# EAGLE design mainboard-1 (EAGLE 5.07)

## Sheet 1 of 3
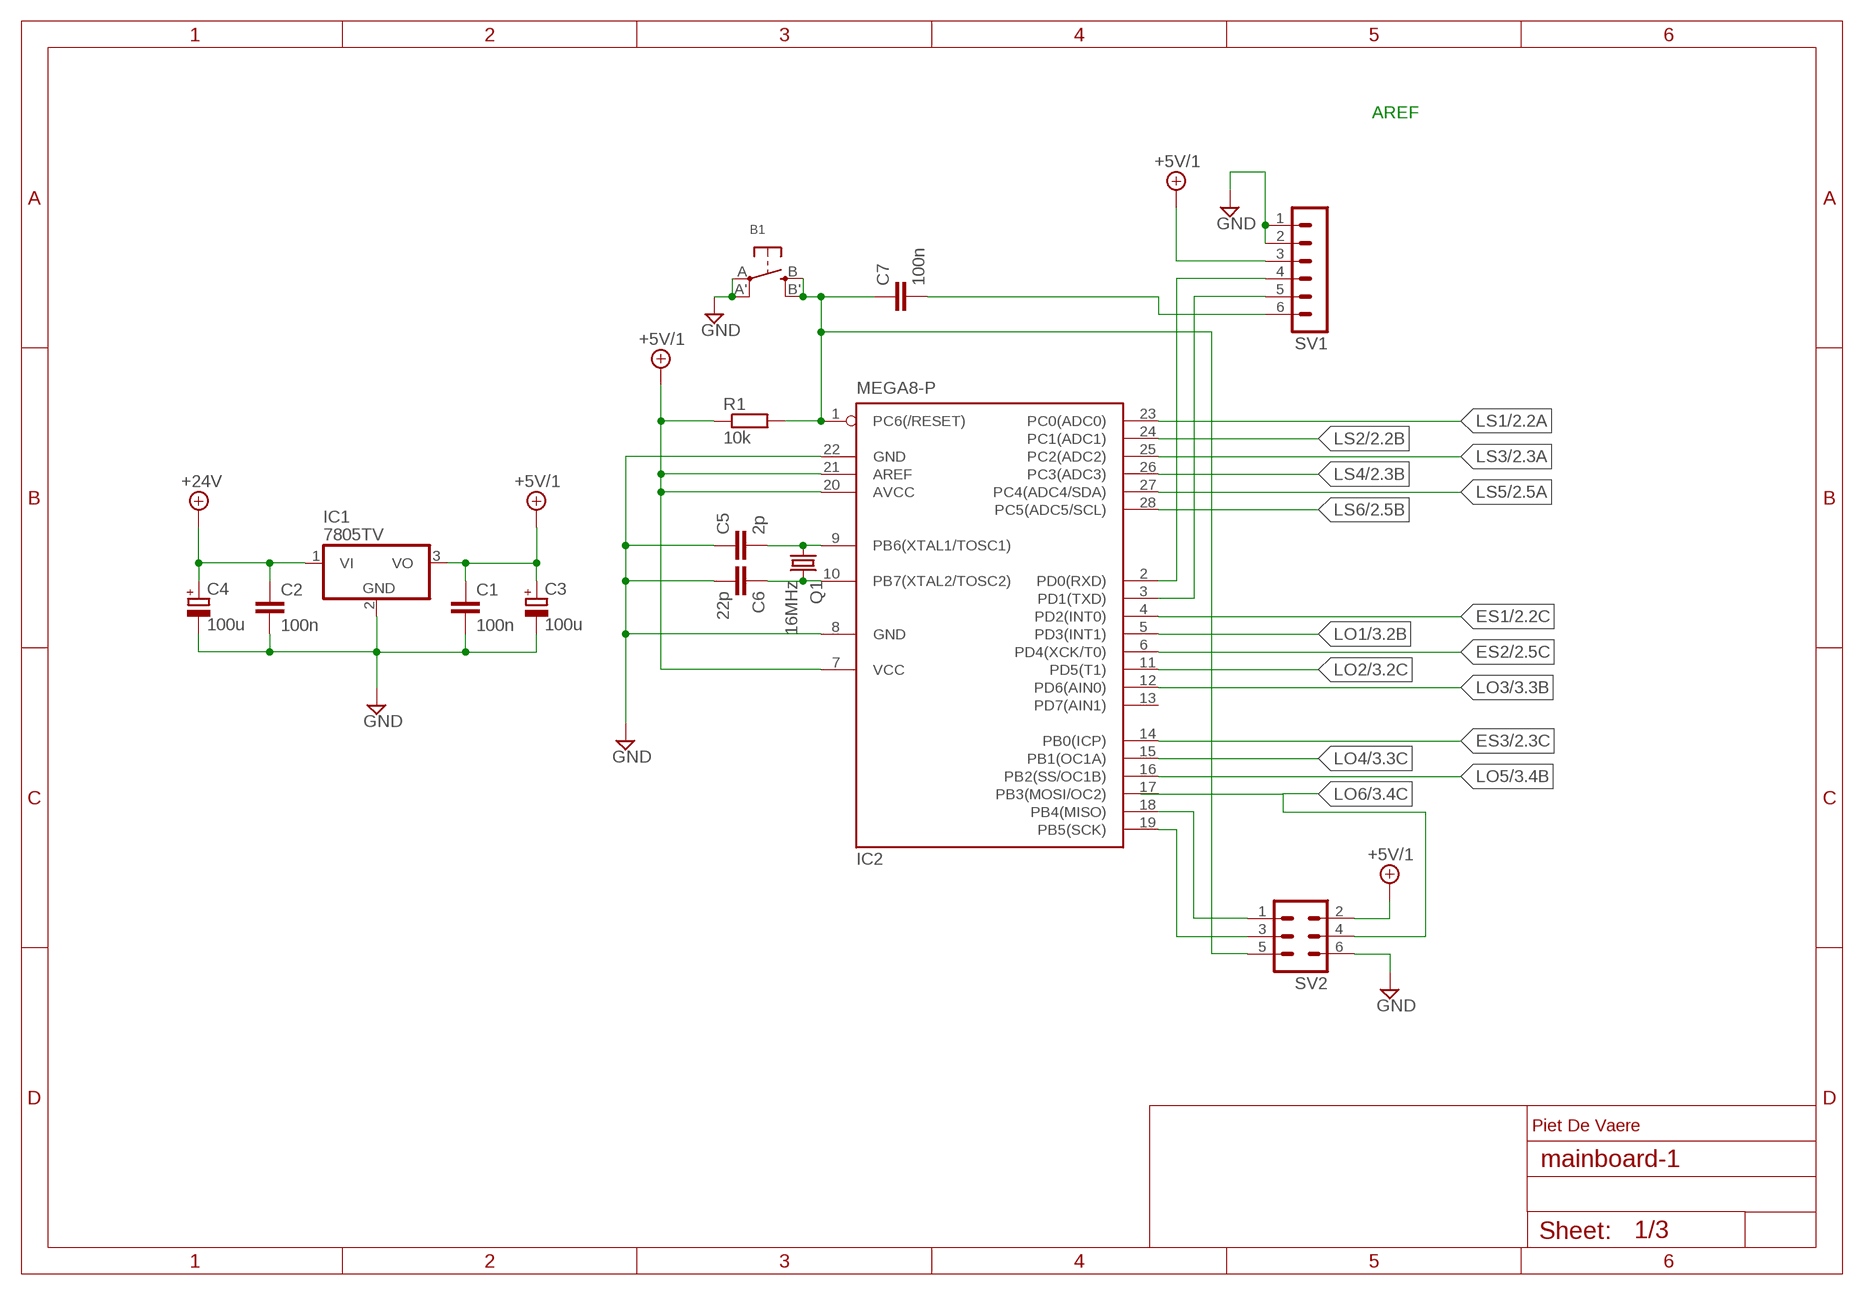
[diagram p0: schematic, sheet 1]

### Parts
B1  SWITCH_TACT_SMT  [EVQ-Q2]
C1  100n  C-EU025-030X050  [C025-030X050]
C2  100n  C-EU025-030X050  [C025-030X050]
C3  100u  CPOL-EUE3.5-10  [E3,5-10]
C4  100u  CPOL-EUE3.5-10  [E3,5-10]
C5  2p  C-EU025-030X050  [C025-030X050]
C6  22p  C-EU025-030X050  [C025-030X050]
C7  100n  C-EU025-030X050  [C025-030X050]
IC1  7805TV  [TO220V]
IC2  MEGA8-P  [DIL28-3]
Q1  16MHz  CRYSTALHC49S  [HC49/S]
R1  10k  R-EU_0207/10  [0207/10]
SV1  MA06-1  [MA06-1]
SV2  MA03-2  [MA03-2]

### Nets
+5V/1: C1.1 C3.+ IC1.3(VO) IC2.7(VCC) IC2.20(AVCC) IC2.21(AREF) R1.1 SV1.3 SV2.2 ; also sheet 2
+24V: C2.1 C4.+ IC1.1(VI)
ES1: IC2.4(PD2(INT0)) ; also sheet 2
ES2: IC2.6(PD4(XCK/T0)) ; also sheet 2
ES3: IC2.14(PB0(ICP)) ; also sheet 2
GND [HP]: B1.A'(P1) B1.A(P) C1.2 C2.2 C3.- C4.- C5.1 C6.2 IC1.2(GND) IC2.8(GND) IC2.22(GND) SV1.1 SV1.2 SV2.6 ; also sheet 2,3
LO1: IC2.5(PD3(INT1)) ; also sheet 3
LO2: IC2.11(PD5(T1)) ; also sheet 3
LO3: IC2.12(PD6(AIN0)) ; also sheet 3
LO4: IC2.15(PB1(OC1A)) ; also sheet 3
LO5: IC2.16(PB2(SS/OC1B)) ; also sheet 3
LO6: SV2.4 ; also sheet 3
LS1: IC2.23(PC0(ADC0)) ; also sheet 2
LS2: IC2.24(PC1(ADC1)) ; also sheet 2
LS3: IC2.25(PC2(ADC2)) ; also sheet 2
LS4: IC2.26(PC3(ADC3)) ; also sheet 2
LS5: IC2.27(PC4(ADC4/SDA)) ; also sheet 2
LS6: IC2.28(PC5(ADC5/SCL)) ; also sheet 2
N$2: C6.1 IC2.10(PB7(XTAL2/TOSC2)) Q1.2
N$3: C5.2 IC2.9(PB6(XTAL1/TOSC1)) Q1.1
N$4: IC2.19(PB5(SCK)) SV2.3
N$5: IC2.18(PB4(MISO)) SV2.1
N$6: IC2.2(PD0(RXD)) SV1.4
N$7: IC2.3(PD1(TXD)) SV1.5
N$8: C7.2 SV1.6
RESET: B1.B'(S1) B1.B(S) C7.1 IC2.1(PC6(/RESET)) R1.2 SV2.5
Unconnected: IC2.13(PD7(AIN1)) IC2.17(PB3(MOSI/OC2))

### Notes on the sheet
- AREF
- Piet De Vaere

## Sheet 2 of 3
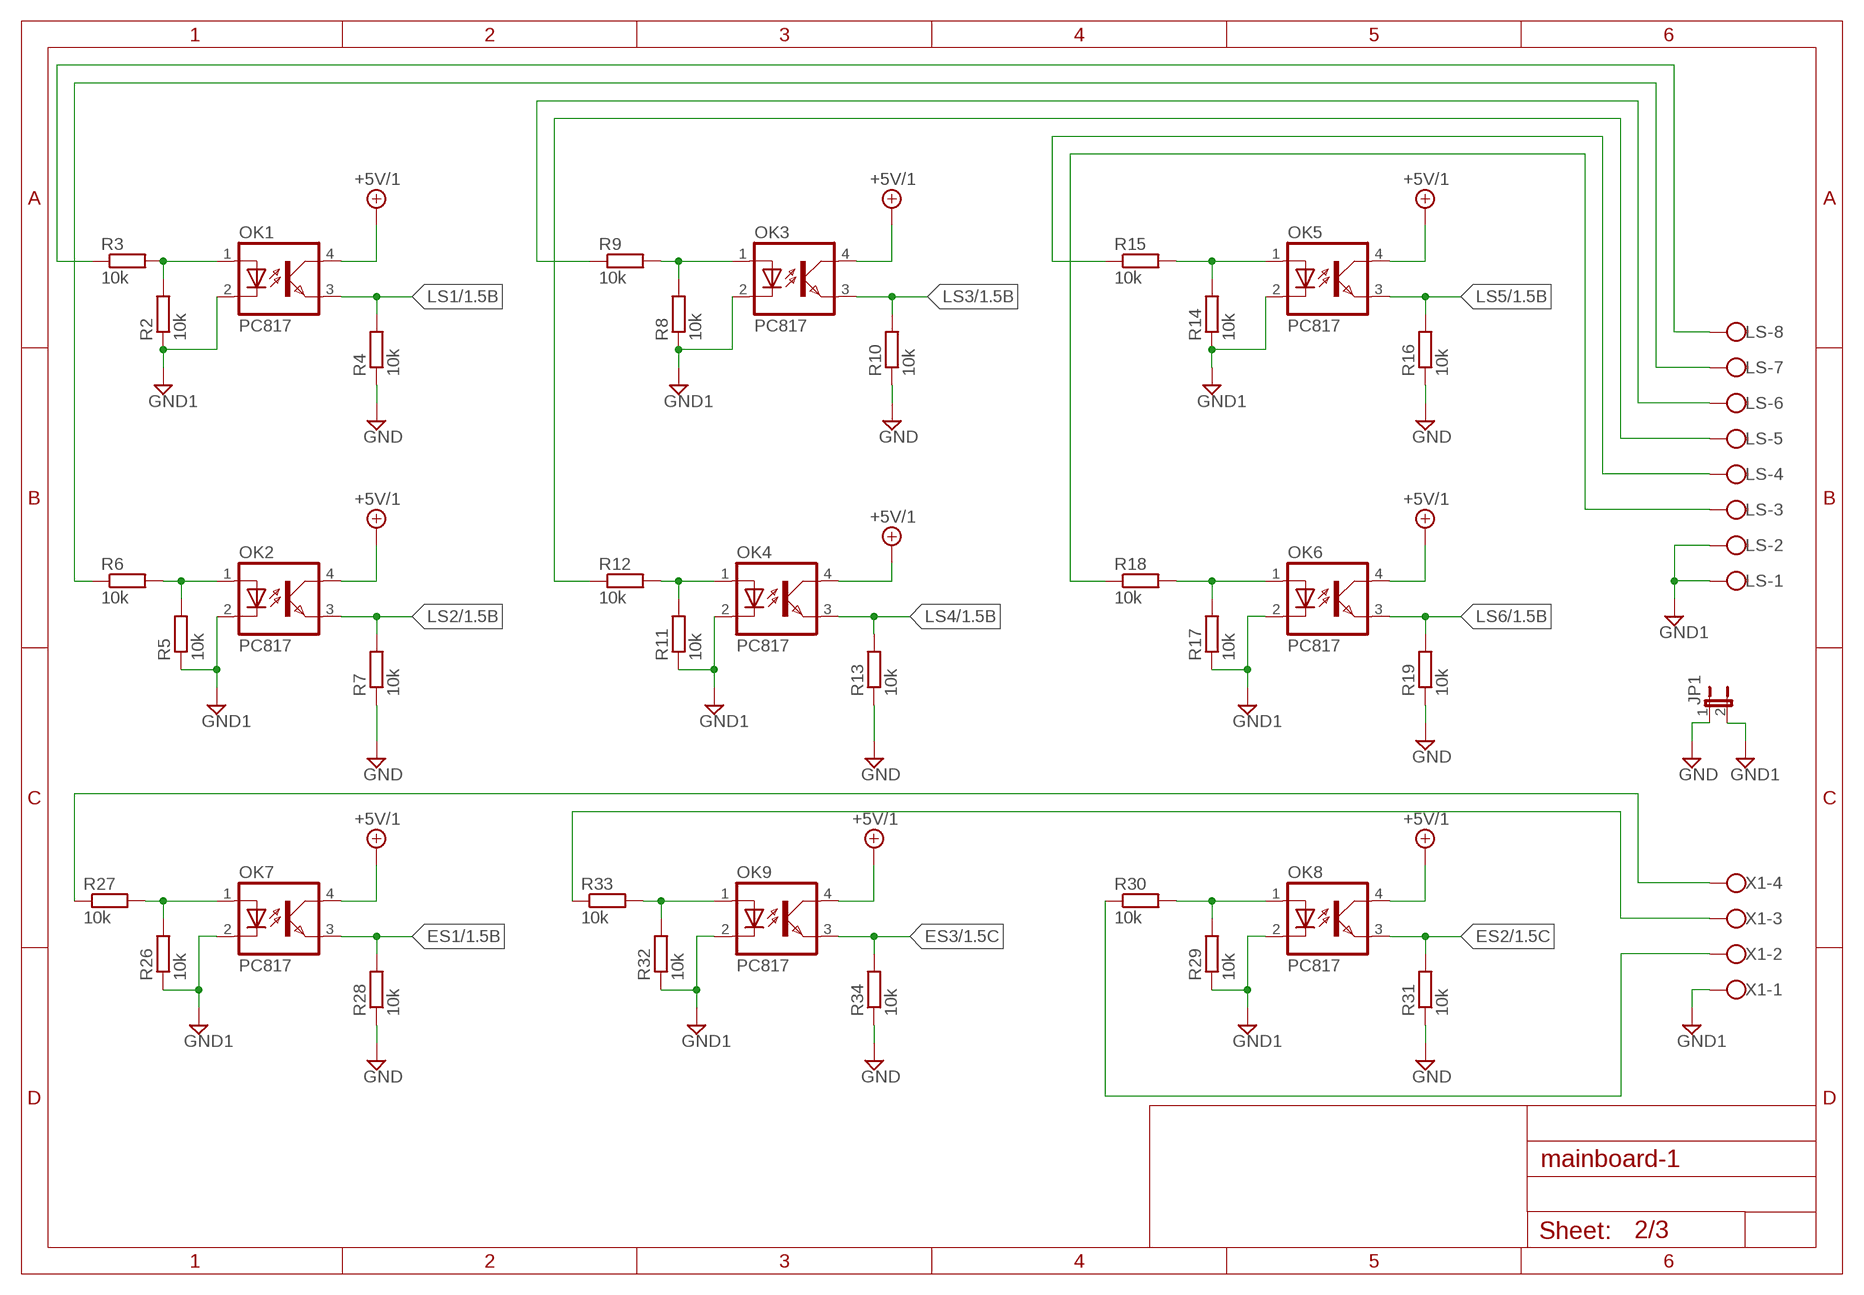
[diagram p1: schematic, sheet 2]

### Parts
JP1  JP1E  [JP1]
LS  W237-08P  [W237-8P]
OK1  PC817  [DIL04]
OK2  PC817  [DIL04]
OK3  PC817  [DIL04]
OK4  PC817  [DIL04]
OK5  PC817  [DIL04]
OK6  PC817  [DIL04]
OK7  PC817  [DIL04]
OK8  PC817  [DIL04]
OK9  PC817  [DIL04]
R2  10k  R-EU_0207/10  [0207/10]
R3  10k  R-EU_0207/10  [0207/10]
R4  10k  R-EU_0207/10  [0207/10]
R5  10k  R-EU_0207/10  [0207/10]
R6  10k  R-EU_0207/10  [0207/10]
R7  10k  R-EU_0207/10  [0207/10]
R8  10k  R-EU_0207/10  [0207/10]
R9  10k  R-EU_0207/10  [0207/10]
R10  10k  R-EU_0207/10  [0207/10]
R11  10k  R-EU_0207/10  [0207/10]
R12  10k  R-EU_0207/10  [0207/10]
R13  10k  R-EU_0207/10  [0207/10]
R14  10k  R-EU_0207/10  [0207/10]
R15  10k  R-EU_0207/10  [0207/10]
R16  10k  R-EU_0207/10  [0207/10]
R17  10k  R-EU_0207/10  [0207/10]
R18  10k  R-EU_0207/10  [0207/10]
R19  10k  R-EU_0207/10  [0207/10]
R26  10k  R-EU_0207/10  [0207/10]
R27  10k  R-EU_0207/10  [0207/10]
R28  10k  R-EU_0207/10  [0207/10]
R29  10k  R-EU_0207/10  [0207/10]
R30  10k  R-EU_0207/10  [0207/10]
R31  10k  R-EU_0207/10  [0207/10]
R32  10k  R-EU_0207/10  [0207/10]
R33  10k  R-EU_0207/10  [0207/10]
R34  10k  R-EU_0207/10  [0207/10]
X1  W237-04P  [W237-4P]

### Nets
+5V/1: OK1.4(COL) OK2.4(COL) OK3.4(COL) OK4.4(COL) OK5.4(COL) OK6.4(COL) OK7.4(COL) OK8.4(COL) OK9.4(COL) ; also sheet 1
ES1: OK7.3(EMIT) R28.2 ; also sheet 1
ES2: OK8.3(EMIT) R31.2 ; also sheet 1
ES3: OK9.3(EMIT) R34.2 ; also sheet 1
GND [HP]: JP1.1 R4.1 R7.1 R10.1 R13.1 R16.1 R19.1 R28.1 R31.1 R34.1 ; also sheet 1,3
GND1: JP1.2 LS.1 LS.2 OK1.2(C) OK2.2(C) OK3.2(C) OK4.2(C) OK5.2(C) OK6.2(C) OK7.2(C) OK8.2(C) OK9.2(C) R2.1 R5.1 R8.1 R11.1 R14.1 R17.1 R26.1 R29.1 R32.1 X1.1
LS1: OK1.3(EMIT) R4.2 ; also sheet 1
LS2: OK2.3(EMIT) R7.2 ; also sheet 1
LS3: OK3.3(EMIT) R10.2 ; also sheet 1
LS4: OK4.3(EMIT) ; also sheet 1
LS5: OK5.3(EMIT) R16.2 ; also sheet 1
LS6: OK6.3(EMIT) R19.2 ; also sheet 1
N$1: OK1.1(A) R2.2 R3.2
N$10: LS.8 R3.1
N$11: OK2.1(A) R5.2 R6.2
N$12: LS.7 R6.1
N$13: OK3.1(A) R8.2 R9.2
N$14: LS.6 R9.1
N$15: OK4.1(A) R11.2 R12.2
N$16: LS.5 R12.1
N$17: OK5.1(A) R14.2 R15.2
N$18: LS.4 R15.1
N$19: OK6.1(A) R17.2 R18.2
N$20: LS.3 R18.1
N$26: OK7.1(A) R26.2 R27.2
N$27: OK8.1(A) R29.2 R30.2
N$28: R27.1 X1.4
N$29: R33.1 X1.3
N$30: OK9.1(A) R32.2 R33.2
N$31: R30.1 X1.2
N$33: R13.2

## Sheet 3 of 3
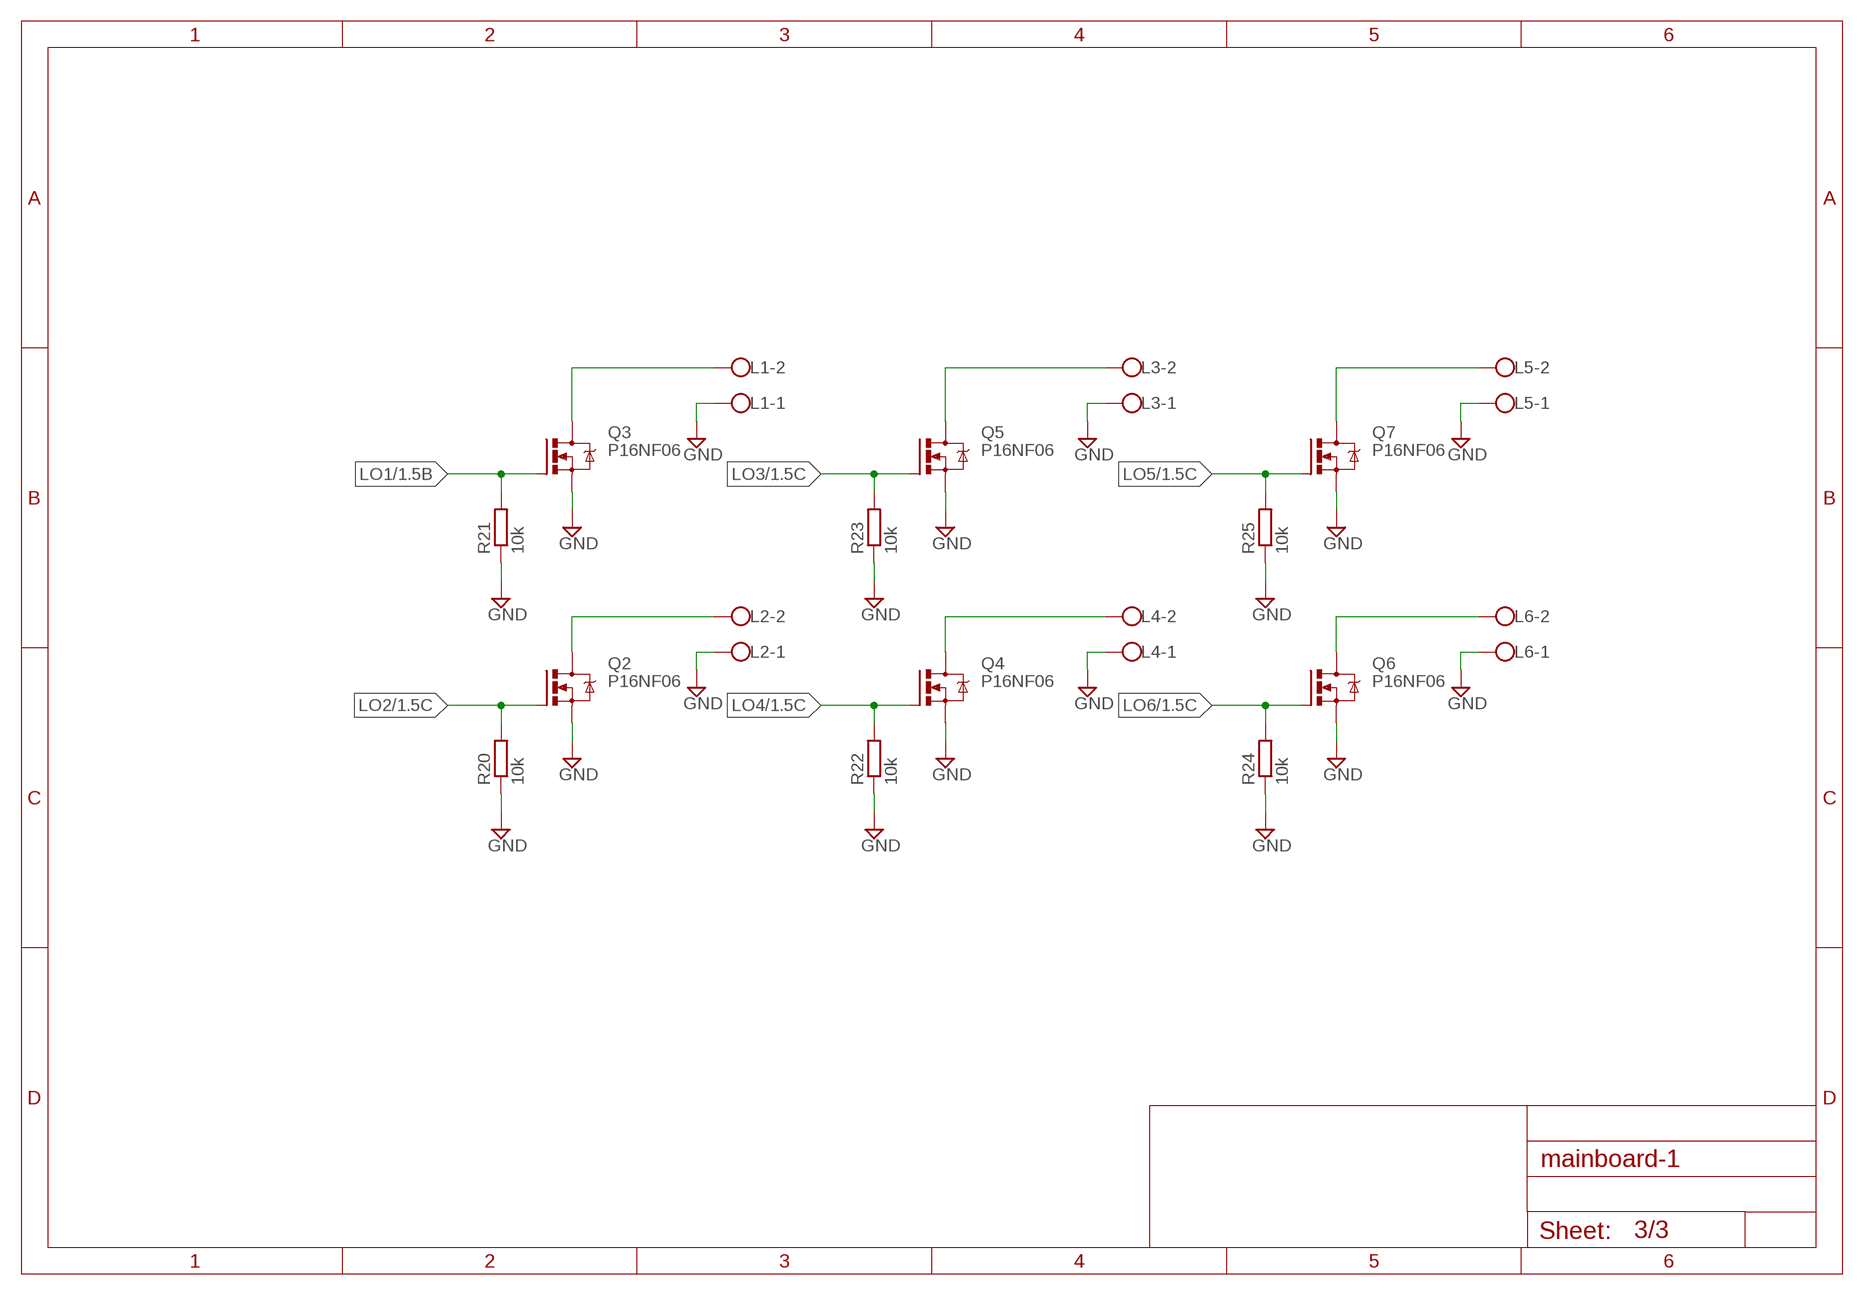
[diagram p2: schematic, sheet 3]

### Parts
L1  W237-02P  [W237-132]
L2  W237-02P  [W237-132]
L3  W237-02P  [W237-132]
L4  W237-02P  [W237-132]
L5  W237-02P  [W237-132]
L6  W237-02P  [W237-132]
Q2  P16NF06  IRF530  [TO220BV]
Q3  P16NF06  IRF530  [TO220BV]
Q4  P16NF06  IRF530  [TO220BV]
Q5  P16NF06  IRF530  [TO220BV]
Q6  P16NF06  IRF530  [TO220BV]
Q7  P16NF06  IRF530  [TO220BV]
R20  10k  R-EU_0207/7  [0207/7]
R21  10k  R-EU_0207/7  [0207/7]
R22  10k  R-EU_0207/7  [0207/7]
R23  10k  R-EU_0207/7  [0207/7]
R24  10k  R-EU_0207/7  [0207/7]
R25  10k  R-EU_0207/7  [0207/7]

### Nets
GND [HP]: L1.1 L2.1 L3.1 L4.1 L5.1 L6.1 Q2.S Q3.S Q4.S Q5.S Q6.S Q7.S R20.1 R21.1 R22.1 R23.1 R24.1 R25.1 ; also sheet 1,2
LO1: Q3.G R21.2 ; also sheet 1
LO2: Q2.G R20.2 ; also sheet 1
LO3: Q5.G R23.2 ; also sheet 1
LO4: Q4.G R22.2 ; also sheet 1
LO5: Q7.G R25.2 ; also sheet 1
LO6: Q6.G R24.2 ; also sheet 1
N$9 [HP]: L1.2 Q3.D
N$21 [HP]: L2.2 Q2.D
N$22 [HP]: L3.2 Q5.D
N$23 [HP]: L4.2 Q4.D
N$24 [HP]: L5.2 Q7.D
N$25 [HP]: L6.2 Q6.D

## Library data of the parts
B1 = microbuilder:SWITCH_TACT_SMT: SMT Tact Switches 6x6mm - Digikey: P12940SCT-ND KMR2 (4.6x2.8mm) - Digikey: 401-1426-1-ND EVQ-PQHB55 - Light Touch, 160GF (4.5x4.5mm) - Digikey: P8090SCT-ND
C1 C2 C5-C7 = resistor:C-EU: CAPACITOR, European symbol
C3 C4 = resistor:CPOL-EU: POLARIZED CAPACITOR, European symbol
IC1 = linear:78*: Positive VOLTAGE REGULATOR Source: http://cache.national.com/ds/LM/LM78L05.pdf http://www.fairchildsemi.com/ds/LM/LM7805.pdf
IC2 = atmel:MEGA8-P: MICROCONTROLLER 8 Kbytes FLASH, 1 kbytes SRAM, 512 bytes EEPROM, USART, 4-channel 10 bit ADC, 2-channel 8 bit ADC Pin compatible with Atmega48, ATMega88, ATMega168 Source: avr.lbr
JP1 = jumper:JP1E: JUMPER
L1-L6 = con-wago-508:W237-02P: WAGO SREW CLAMP
LS = con-wago-508:W237-08P: WAGO SREW CLAMP
OK1-OK9 = optocoupler:PC817: SHARP OPTO COUPLER
Q1 = crystal:CRYSTAL: CRYSTAL
Q2-Q7 = transistor-power:IRF530: HEXFET Power MOSFET
R1-R34 = resistor:R-EU_: RESISTOR, European symbol
SV1 = con-lstb:MA06-1: PIN HEADER
SV2 = con-lstb:MA03-2: PIN HEADER
X1 = con-wago-508:W237-04P: WAGO SREW CLAMP

## Net classes
0 default: width 0.7 mm
1 HP: width 2 mm, clearance 0.71 mm

## Board
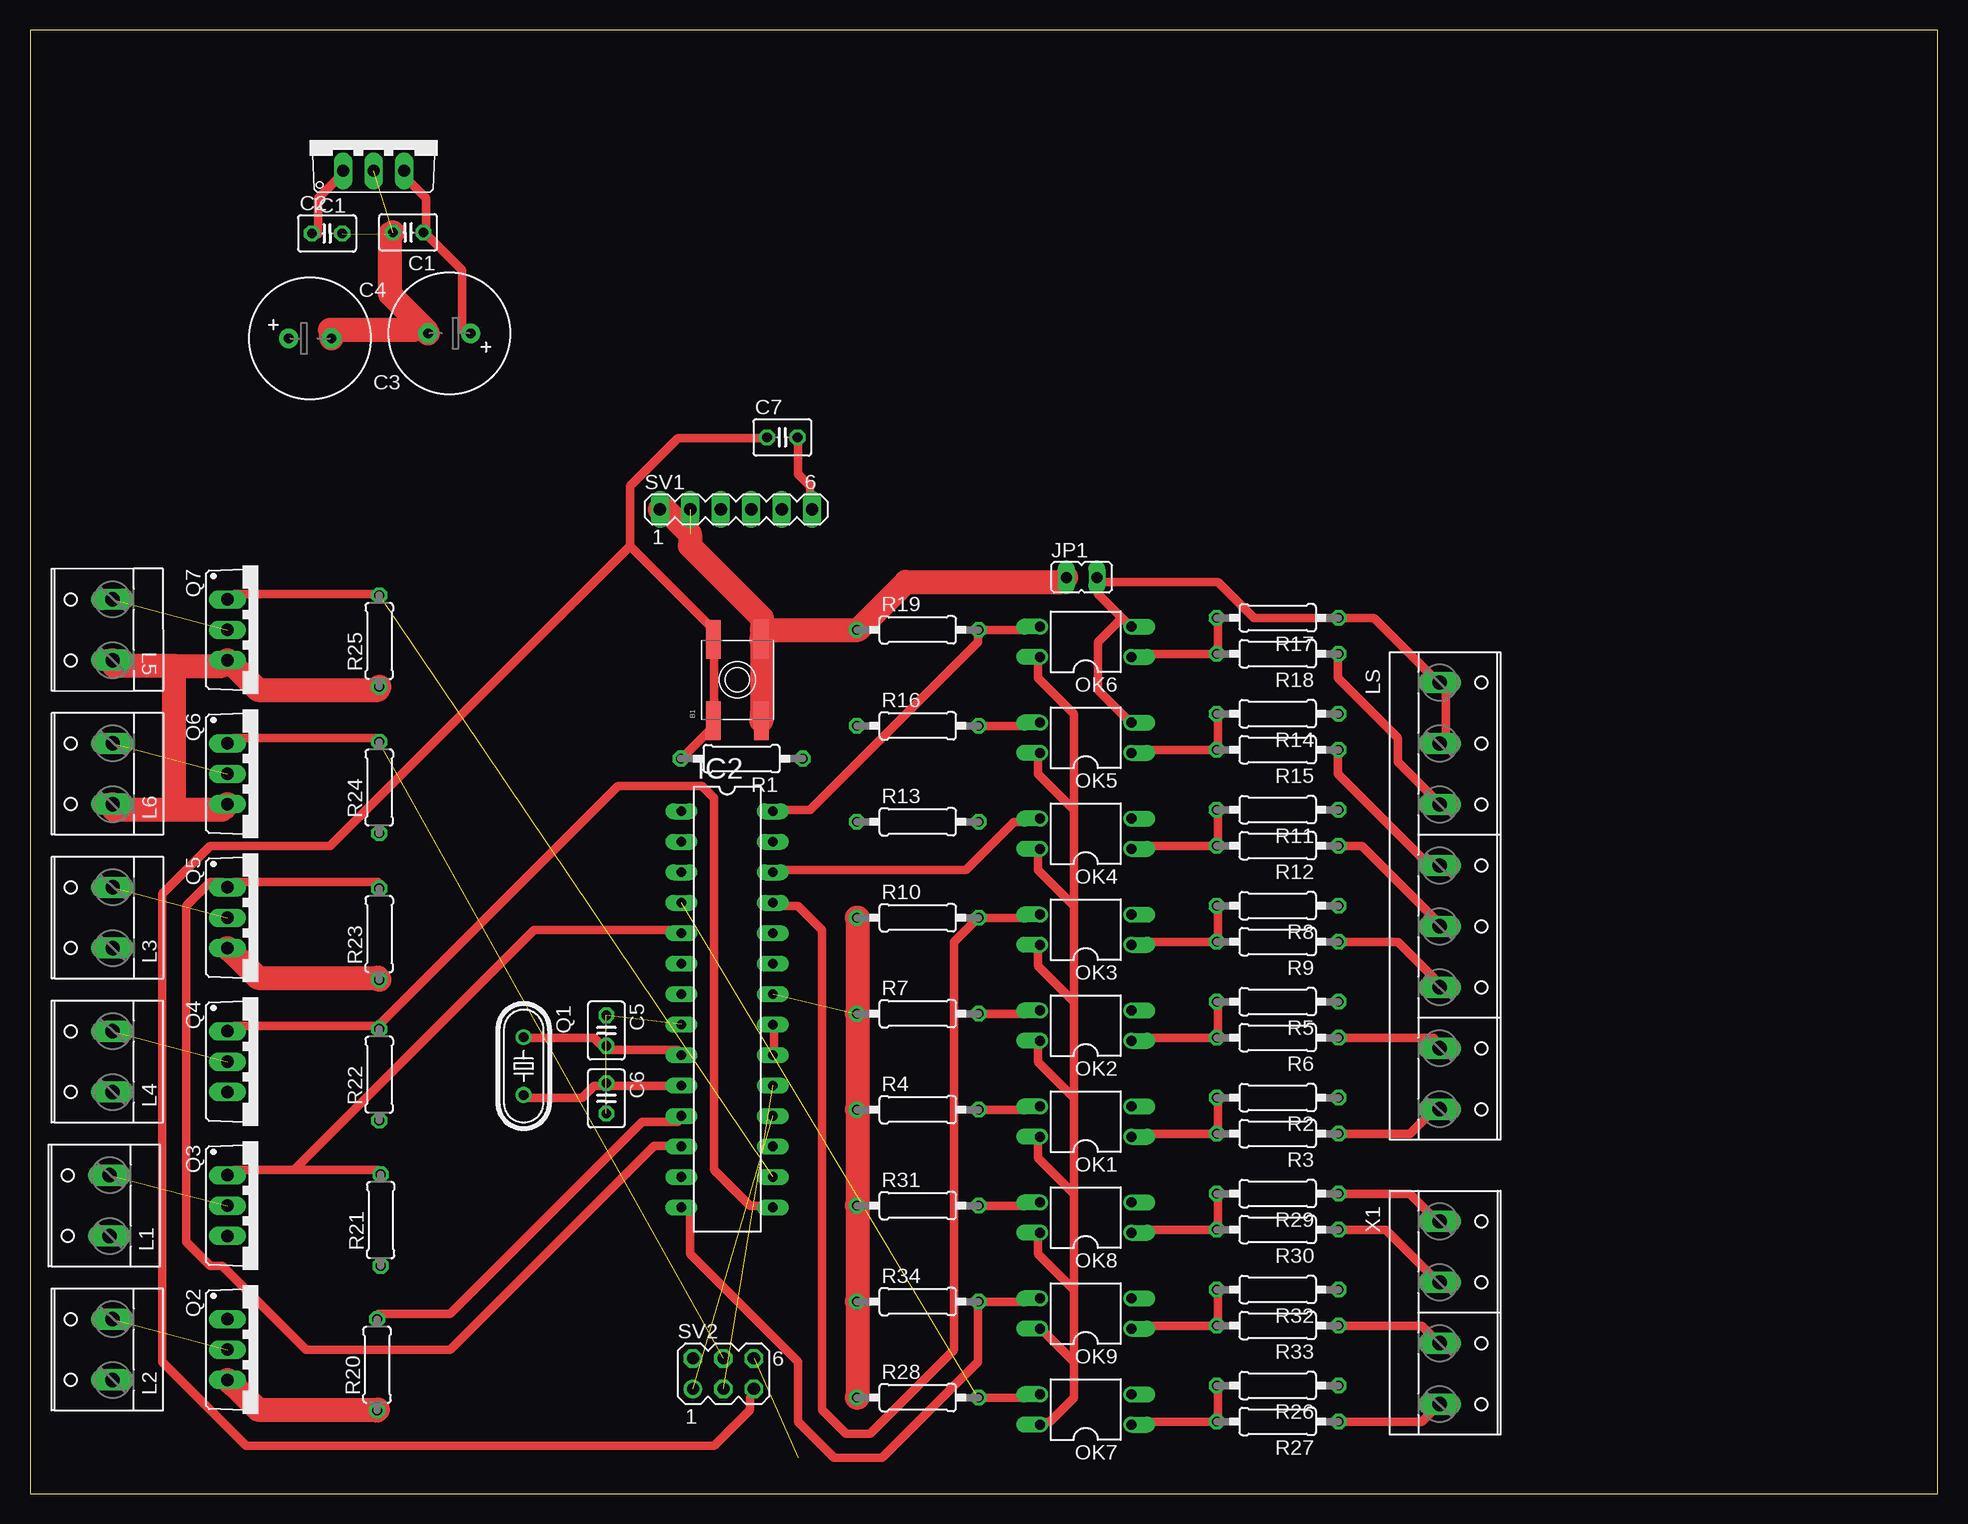
[diagram p3: board, top side]
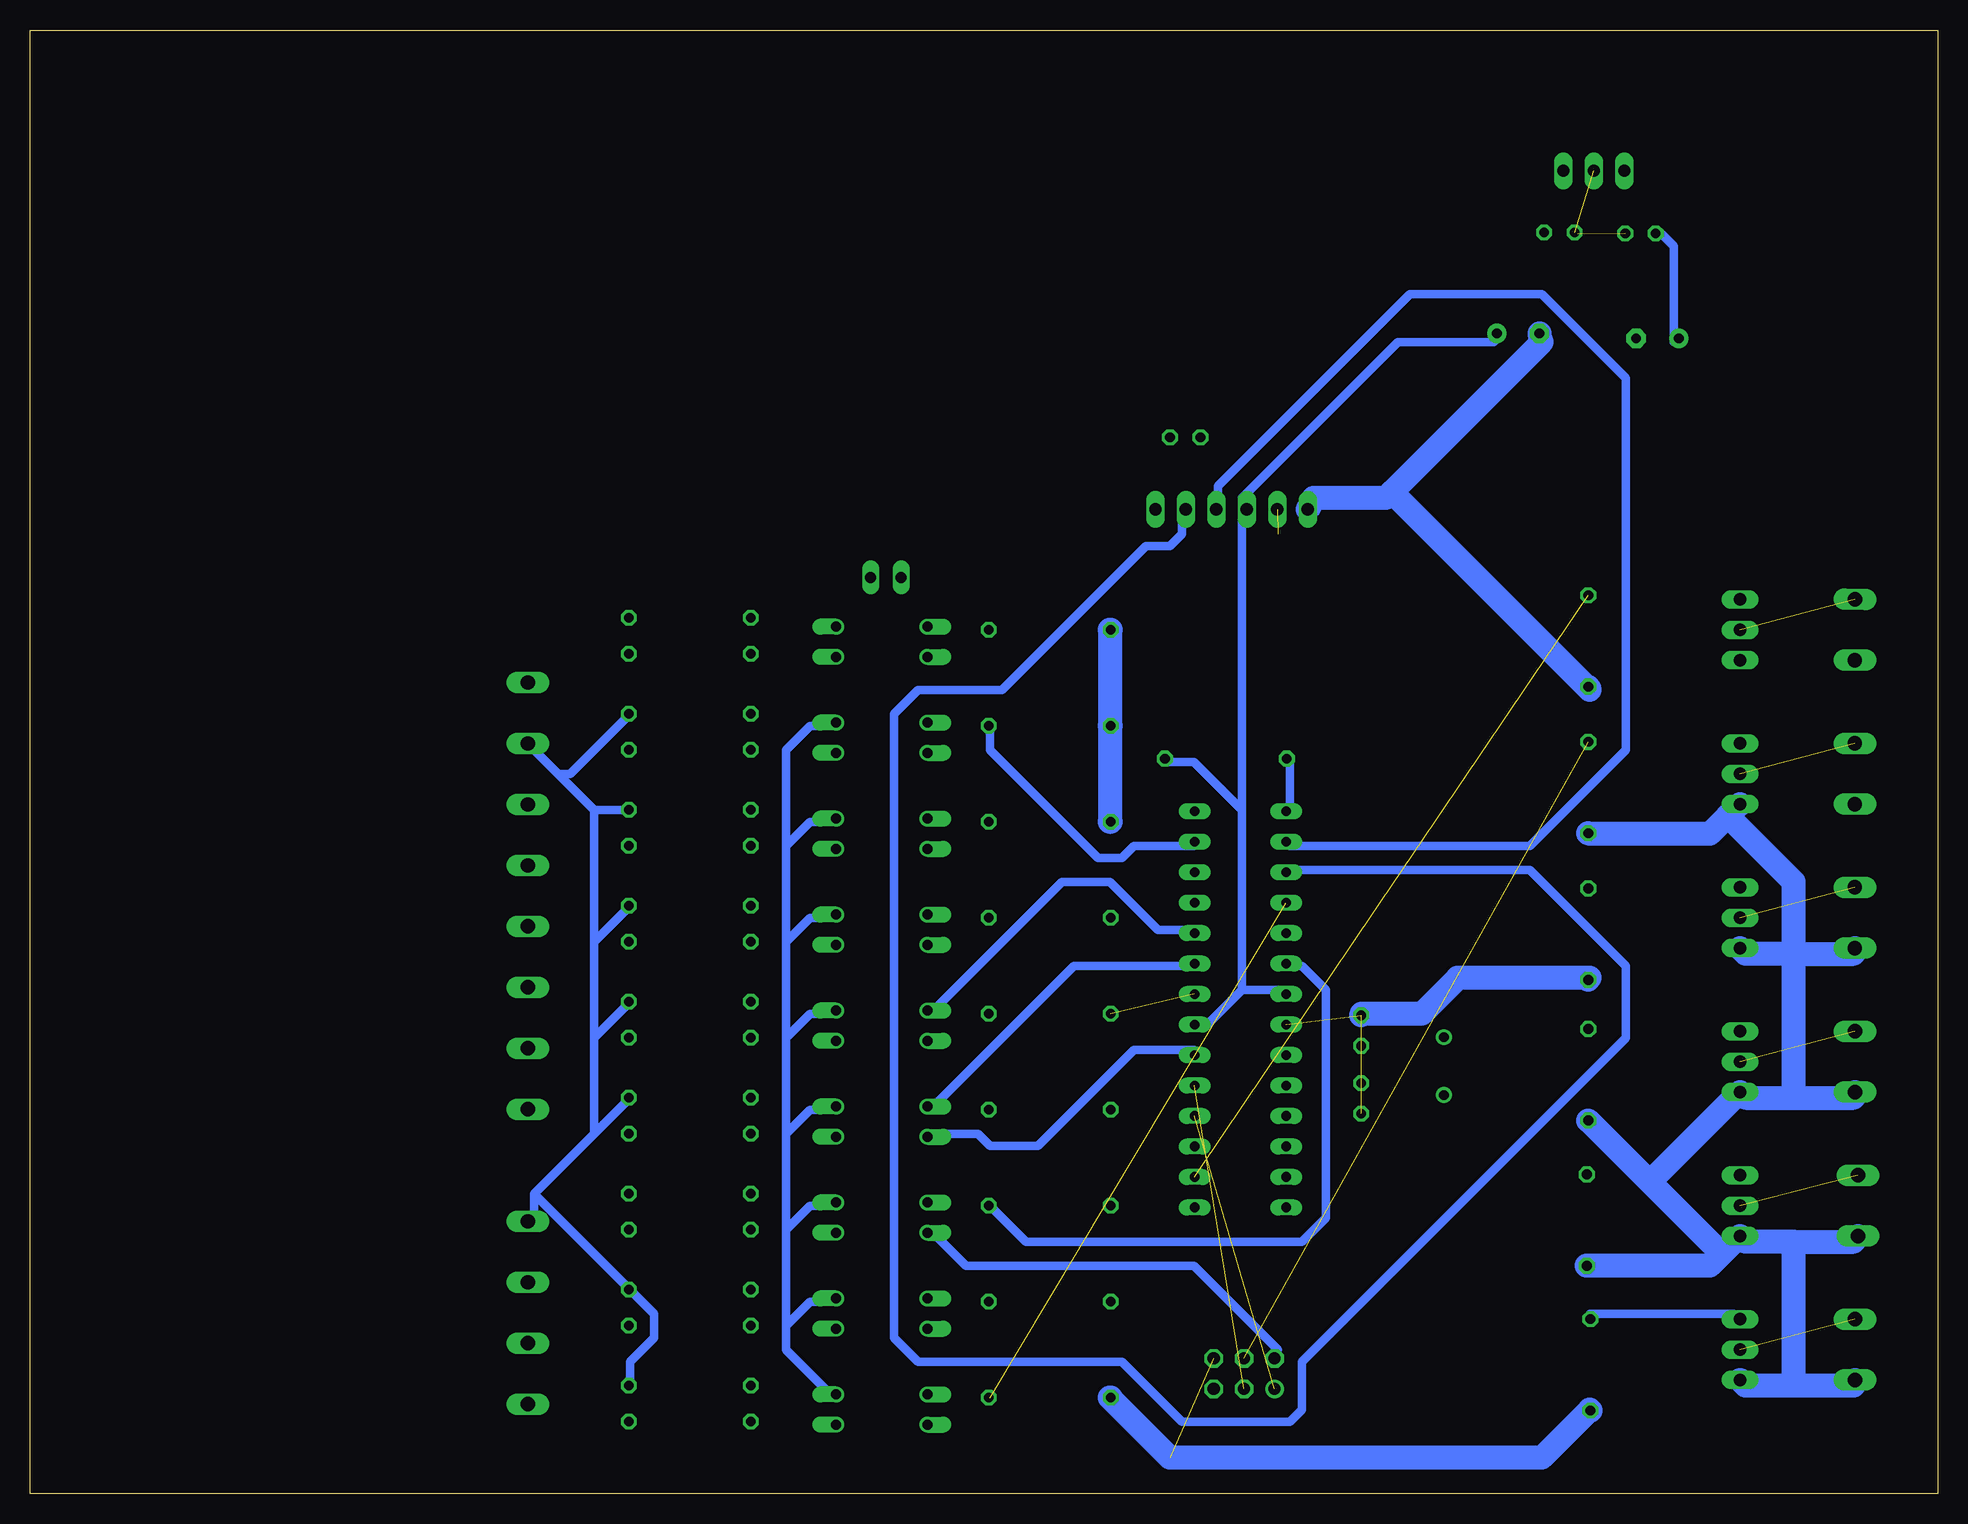
[diagram p4: board, bottom side, seen from below]

Size 159 x 122 mm. Coordinates in mm from the lower left corner, seen from the top.
Outline: 0,0 159,0 159,122 0,122 0,0
Copper layers (1*16): Top 0.035mm / dielectric 1.5mm / Bottom 0.035mm
Design rules "default *": minimum track width 10mil, minimum drill 24mil, track to track 1mm, track to pad 1mm, pad to pad 1mm, via to via 1mm, smd to smd 8mil, copper to edge 40mil, drill to drill 8mil, minimum pad ring 10mil, minimum via ring 8mil, stop-mask expansion 4mil, vias tented up to drill 0mil, thermal gap 10mil

### Footprints (pad centres in the part's own frame; a part is rotated, then mirrored left to right if it is on the bottom)
EVQ-Q2 = smd 3.2 x 1.2: A -3.4,-2; A' 3.4,-2; B -3.4,2; B' 3.4,2
C025-030X050 = drill 0.813 octagon: 1 -1.27,0; 2 1.27,0
E3,5-10 = drill 0.813 pad 1.6 round: + -1.778,0 | drill 0.813 pad 1.6 octagon: - 1.778,0
TO220V = drill 1.016 long: 1 -2.54,-2.54; 2 0,-2.54; 3 2.54,-2.54
DIL28-3 = drill 0.813 long: 1 -16.51,-3.81; 2 -13.97,-3.81; 3 -11.43,-3.81; 4 -8.89,-3.81; 5 -6.35,-3.81; 6 -3.81,-3.81; 7 -1.27,-3.81; 8 1.27,-3.81; 9 3.81,-3.81; 10 6.35,-3.81; 11 8.89,-3.81; 12 11.43,-3.81; 13 13.97,-3.81; 14 16.51,-3.81; 15 16.51,3.81; 16 13.97,3.81; 17 11.43,3.81; 18 8.89,3.81; 19 6.35,3.81; 20 3.81,3.81; 21 1.27,3.81; 22 -1.27,3.81; 23 -3.81,3.81; 24 -6.35,3.81; 25 -8.89,3.81; 26 -11.43,3.81; 27 -13.97,3.81; 28 -16.51,3.81
JP1 = drill 0.914 long: 1 0,-1.27; 2 0,1.27
W237-132 = drill 1.194 long: 1 -2.54,-0.635; 2 2.54,-0.635
W237-8P = drill 1.194 long: 1 -17.78,-0.635; 2 -12.7,-0.635; 3 -7.62,-0.635; 4 -2.54,-0.635; 5 2.54,-0.635; 6 7.62,-0.635; 7 12.7,-0.635; 8 17.78,-0.635
DIL04 = drill 0.813 offset: 1 -1.27,-3.81; 2 1.27,-3.81; 3 1.27,3.81; 4 -1.27,3.81
HC49/S = drill 0.813 round: 1 -2.413,0; 2 2.413,0
TO220BV = drill 1.016 long: D 0,-2.54; G -2.54,-2.54; S 2.54,-2.54
0207/10 = drill 0.813 octagon: 1 -5.08,0; 2 5.08,0
0207/7 = drill 0.813 octagon: 1 -3.81,0; 2 3.81,0
MA06-1 = drill 1.016 long: 1 -6.35,0; 2 -3.81,0; 3 -1.27,0; 4 1.27,0; 5 3.81,0; 6 6.35,0
MA03-2 = drill 1.016 round: 1 -2.54,-1.27 | drill 1.016 octagon: 2 -2.54,1.27; 3 0,-1.27; 4 0,1.27; 5 2.54,-1.27; 6 2.54,1.27
W237-4P = drill 1.194 long: 1 -7.62,-0.635; 2 -2.54,-0.635; 3 2.54,-0.635; 4 7.62,-0.635

### Placement (x,y rotation side)
B1  58.96,67.82 90 top
C1  31.52,105.12 180 top
C2  24.76,105.04 0 top
C3  34.96,96.71 180 top
C4  23.34,96.29 0 top
C5  48.04,38.59 270 top
C6  48.04,32.94 270 top
C7  62.71,88.04 0 top
IC1  28.64,112.8 0 top
IC2  58.11,40.36 270 top
JP1  87.66,76.36 270 top
L1  6,24 90 top
L2  6.25,12 90 top
L3  6.26,48 90 top
L4  6.25,36 90 top
L5  6.25,72 90.1 top
L6  6.26,60 90 top
LS  118.14,49.82 270 top
OK1  88,31 90 top
OK2  88,39 90 top
OK3  88,47 90 top
OK4  88,55 90 top
OK5  88,63 90 top
OK6  88,71 90 top
OK7  88,7 90 top
OK8  88,23 90 top
OK9  88,15 90 top
Q1  41.15,35.63 270 top
Q2  19,12 270 top
Q3  19,24 270 top
Q4  19,36 270 top
Q5  19,48 270 top
Q6  19,60 270 top
Q7  19,72 270 top
R1  59.32,61.26 180 top
R2  104,33 180 top
R3  104,30 180 top
R4  74,32 0 top
R5  104,41 180 top
R6  104,38 180 top
R7  74,40 0 top
R8  104,49 180 top
R9  104,46 180 top
R10  74,48 0 top
R11  104,57 180 top
R12  104,54 180 top
R13  74,56 0 top
R14  104,65 180 top
R15  104,62 180 top
R16  74,64 0 top
R17  104,73 180 top
R18  104,70 180 top
R19  74,72 0 top
R20  28.93,10.73 90 top
R21  29.23,22.79 90 top
R22  29.11,34.91 90 top
R23  29.11,46.63 90 top
R24  29.11,58.85 90 top
R25  29.11,71.07 90 top
R26  104,9 180 top
R27  104,6 180 top
R28  74,8 0 top
R29  104,25 180 top
R30  104,22 180 top
R31  74,24 0 top
R32  104,17 180 top
R33  104,14 180 top
R34  74,16 0 top
SV1  58.85,82.04 0 top
SV2  57.8,9.99 0 top
X1  118.14,15.07 270 top

### Tracks (layer width: path | path; a pad name or v marks a point on that pad's centre or on a via)
+5V/1
  Top 0.7: 87,11 87,8 85,6 84,6 OK7.4 | 87,11 84,14 OK9.4 | 87,17 84,20 84,22 OK8.4 | 87,17 87,11 | 87,25 84,28 84,30 OK1.4 | 87,17 87,25 | 87,33 84,36 84,38 OK2.4 | 87,25 87,33 | 87,41 84,44 84,46 OK3.4 | 87,33 87,41 | 87,49 84,52 84,54 OK4.4 | 87,41 87,49 | 87,57 84,60 84,62 OK5.4 | 87,49 87,57 | 87,57 87,65 84,68 84,70 OK6.4 | 33,105 33,108 31,110 IC1.3 | 33,105 36,102 36,97 C3.+ | 33,105 C1.1 | IC2.20 62,37 62,39 IC2.21
  Bottom 0.7: SV2.2 55,12 62,19 81,19 84,22 OK8.4 | 58,42 55,42 IC2.7 | 58,42 61,39 IC2.21 | 58,57 62,61 64,61 R1.1 | 58,42 58,57 | 58,57 58,82 SV1.3 58,83 45,96 37,96 C3.+ | OK1.4 84,30 80,30 79,29 75,29 67,37 62,37 IC2.20
+24V
  Top 0.7: C2.1 24,105 24,108 26,110 IC1.1
  Bottom 0.7: C4.+ 22,96 22,104 23,105 C2.1
ES1  (1 unrouted)
  Top 0.7: 79,8 R28.2 84,8 OK7.3
ES2
  Top 0.7: 79,24 R31.2 84,24 OK8.3
  Bottom 0.7: IC2.6 54,44 53,44 51,42 51,23 53,21 76,21 79,24 R31.2
ES3
  Top 0.7: IC2.14 55,24 55,20 64,11 64,6 67,3 71,3 79,11 79,16 R34.2 84,16 OK9.3
GND  (7 unrouted)
  Top 2: R23.1 29,43 19,43 17,45 Q5.S | 69,40 69,48 R10.1 | 69,16 69,8 R28.1 | 69,24 69,32 | 69,16 69,24 | 69,16 R34.1 | 69,24 R31.1 | 69,32 69,40 | 69,40 R7.1 | 69,32 R4.1 | R20.1 29,7 19,7 17,9 Q2.S | R25.1 29,67 19,67 17,69 Q7.S 16,69 12,69 | 12,69 7,69 L5.1 | 12,57 16,57 Q6.S | 12,57 7,57 L6.1 | 12,57 12,69 | 32.5,97.5 33,97 C3.- | 32.5,97.5 30,100 30,105 C1.2 | C4.- 25,97 32,97 32.5,97.5 | 61,72 R19.1 69,72 73,76 86,76 JP1.1 | 61,72 B1.A' 61,71 61,65 B1.A | SV1.1 53,82 55,80 55,79 61,73 61,72
  Bottom 2: C5.1 48,40 43,40 40,43 29,43 R23.1 | 12,45 7,45 L3.1 | 12,45 16,45 Q5.S | 12,33 7,33 L4.1 | 12,33 16,33 Q4.S 17,33 24,26 | 12,33 12,45 | 12,9 16,9 Q2.S | 12,9 7,9 L2.1 | 18,20 17,21 Q3.S 16,21 12,21 | 18,20 19,19 29,19 R21.1 | 18,20 24,26 | 24,26 29,31 R22.1 | 12,21 7,21 L1.1 | 12,9 12,21 | R28.1 69,8 64,3 33,3 29,7 R20.1 | 17.5,56.5 17,57 Q6.S | 17.5,56.5 19,55 29,55 R24.1 | 69,64 69,56 R13.1 | 69,64 69,72 R19.1 | 69,64 R16.1 | 45.5,83.5 46,83 52,83 SV1.1 | 45.5,83.5 33,96 C3.- | R25.1 29,67 45.5,83.5 | 12,45 12,51 17.5,56.5
GND1
  Top 0.7: LS.2 118,63 118,67 LS.1 117,68 112,73 R17.1 109,73 102,73 99,76 89,76 | 109,25 R29.1 115,25 117,23 X1.1 | 91,73 89,75 89,76 | 91,73 92,72 OK6.2 | 91,73 89,71 89,67 92,64 OK5.2 | 89,76 JP1.2
  Bottom 0.7: 112,57 R11.1 109,57 | 115,60 117,62 LS.2 | 115,60 112,57 | 115,60 114,60 109,65 R14.1 | 109,17 107,15 107,13 109,11 109,9 R26.1 | 112,30 117,25 | 112,30 109,33 R2.1 | 117,25 117,23 X1.1 | 112,38 109,41 R5.1 | 112,38 112,30 | 112,46 109,49 R8.1 | 112,46 112,38 | 117,25 109,17 | 109,17 R32.1 | 112,57 112,46 | 96,14 96,12 92,8 OK7.2 | 96,14 94,16 92,16 OK9.2 | 96,22 94,24 92,24 OK8.2 | 96,14 96,22 | 96,30 94,32 92,32 OK1.2 | 96,22 96,30 | 96,38 94,40 92,40 OK2.2 | 96,30 96,38 | 96,46 94,48 92,48 OK3.2 | 96,38 96,46 | 96,54 94,56 92,56 OK4.2 | 96,46 96,54 | 96,54 96,62 94,64 92,64 OK5.2
LO1
  Top 0.7: 22,27 17,27 Q3.G | 22,27 29,27 R21.2 | 22,27 42,47 54,47 IC2.5
LO2
  Top 0.7: IC2.11 54,31 51,31 35,15 29,15 R20.2
  Bottom 0.7: R20.2 29,15 17,15 Q2.G
LO3
  Top 0.7: R23.2 29,51 17,51 Q5.G 16,51 15,51 13,49 13,21 15,19 16,19 23,12 35,12 52,29 54,29 IC2.12
LO4
  Top 0.7: 29,39 49,59 56,59 57,58 57,27 60,24 61,24 IC2.15 | 29,39 17,39 Q4.G | 29,39 R22.2
LO5  (1 unrouted)
  Top 0.7: R25.2 29,75 17,75 Q7.G
LO6  (1 unrouted)
  Top 0.7: R24.2 29,63 17,63 Q6.G
LS1
  Top 0.7: 79,32 R4.2 84,32 OK1.3
  Bottom 0.7: IC2.23 62,44 72,44 84,32 OK1.3
LS2
  Top 0.7: 79,40 R7.2 84,40 OK2.3
  Bottom 0.7: IC2.24 62,47 65,47 69,51 73,51 84,40 OK2.3
LS3
  Top 0.7: IC2.25 62,49 64,49 66,47 66,7 68,5 70,5 77,12 77,46 79,48 R10.2 84,48 OK3.3
LS4
  Top 0.7: IC2.26 62,52 78,52 82,56 84,56 OK4.3
LS5
  Top 0.7: OK5.3 84,64 R16.2 79,64
  Bottom 0.7: IC2.27 62,54 67,54 68,53 70,53 79,62 79,64 R16.2
LS6
  Top 0.7: IC2.28 62,57 65,57 79,71 79,72 R19.2 84,72 OK6.3
N$1
  Top 0.7: OK1.1 92,30 R3.2 99,30 99,33 R2.2
N$2
  Top 0.7: 48,34 47,34 46,33 41,33 Q1.2 | 48,34 54,34 IC2.10 | 48,34 C6.1
N$3
  Top 0.7: 48,37 47,38 41,38 Q1.1 | 48,37 54,37 IC2.9 | 48,37 C5.2
N$4  (1 unrouted)
N$5  (1 unrouted)
N$6
  Bottom 0.7: IC2.2 54,54 34,54 26,62 26,93 33,100 44,100 60,84 60,83 SV1.4
N$7
  Bottom 0.7: IC2.3 54,52 34,52 26,44 26,38 53,11 53,7 54,6 63,6 68,11 85,11 87,13 87,65 85,67 78,67 66,79 64,79 63,80 63,82 SV1.5
N$8
  Top 0.7: C7.2 64,88 64,85 65,84 65,83 SV1.6
N$9  (1 unrouted)
N$10
  Top 0.7: 109,30 R3.1 115,30 117,32 LS.8
N$11
  Top 0.7: OK2.1 92,38 R6.2 99,38 99,41 R5.2
N$12
  Top 0.7: 109,38 R6.1 117,38 LS.7
N$13
  Top 0.7: OK3.1 92,46 R9.2 99,46 99,49 R8.2
N$14
  Top 0.7: 109,46 R9.1 114,46 117,43 LS.6
N$15
  Top 0.7: OK4.1 92,54 R12.2 99,54 99,57 R11.2
N$16
  Top 0.7: 109,54 R12.1 111,54 117,48 LS.5
N$17
  Top 0.7: OK5.1 92,62 R15.2 99,62 99,65 R14.2
N$18
  Top 0.7: R15.1 109,62 109,60 117,52 LS.4
N$19
  Top 0.7: OK6.1 92,70 R18.2 99,70 99,73 R17.2
N$20
  Top 0.7: R18.1 109,70 109,68 114,63 114,61 117,58 LS.3
N$21  (1 unrouted)
N$22  (1 unrouted)
N$23  (1 unrouted)
N$24  (1 unrouted)
N$25  (1 unrouted)
N$26
  Top 0.7: OK7.1 92,6 R27.2 99,6 99,9 R26.2
N$27
  Top 0.7: OK8.1 92,22 R30.2 99,22 99,25 R29.2
N$28
  Top 0.7: 109,6 R27.1 116,6 117,7 X1.4
N$29
  Top 0.7: 109,14 R33.1 116,14 117,13 X1.3
N$30
  Top 0.7: OK9.1 92,14 R33.2 99,14 99,17 R32.2
N$31
  Top 0.7: 109,22 R30.1 113,22 117,18 X1.2
RESET
  Top 0.7: R1.2 54,61 57,64 B1.B 57,65 57,71 B1.B' 57,72 50,79 | 50,79 50,84 54,88 61,88 C7.1 | 50,79 25,54 15,54 11,50 11,11 18,4 57,4 60,7 60,8 SV2.5
  Bottom 0.7: IC2.1 54,57 54,61 R1.2